# Altium schematic sheet MCU_GATEWAY.SchDoc
size A
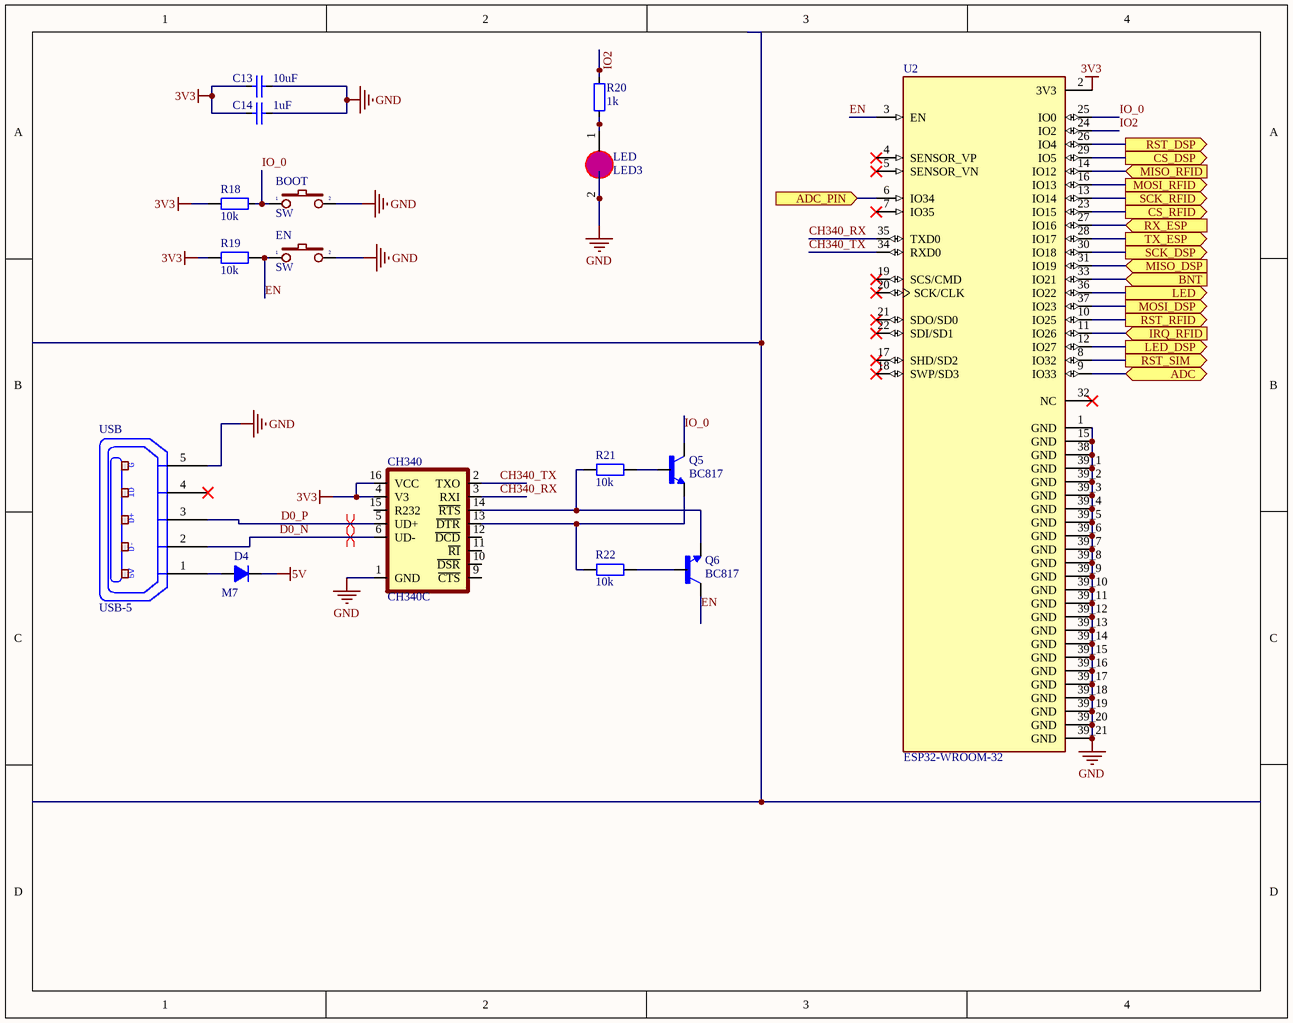
[diagram p0: MCU_GATEWAY.SchDoc]

## Parts
BOOT  SW  [SW-SMD]
C13  10uF  [CAP_0603]
C14  1uF  [CAP_0603]
CH340  CH340C  [SOP-16]
D4  M7  [SMA]
EN  SW  [SW-SMD]
LED  LED3  [LED0805]
Q5  BC817  [SOT95P240X97-3N]
Q6  BC817  [SOT95P240X97-3N]
R18  10k  [RES-SMD-0603]
R19  10k  [RES-SMD-0603]
R20  1k  [RES-SMD-0603]
R21  10k  [RES-SMD-0603]
R22  10k  [RES-SMD-0603]
U2  ESP32-WROOM-32  [MODULE_ESP32-WROOM-32]
USB  USB-5  [USB-M1]

## Ports
ADC (bidir), ADC_PIN (in), BNT (in), CS_DSP (out), CS_RFID (out), IRQ_RFID (in), LED (out), LED_DSP (out), MISO_DSP (in), MISO_RFID (in), MOSI_DSP (out), MOSI_RFID (out), RST_DSP (out), RST_RFID (out), RST_SIM (out), RX_ESP (in), SCK_DSP (out), SCK_RFID (out), TX_ESP (out)

## Nets
3V3: C13.1 C14.1 CH340.4(V3) CH340.16(VCC) R18.1 R19.1 U2.2(3V3)
5V: D4.2(K)
GND: BOOT.2 C13.2 C14.2 CH340.1(GND) EN.2 LED.2(K) U2.1(GND) U2.15(GND) U2.38(GND) U2.39_1(GND) U2.39_2(GND) U2.39_3(GND) U2.39_4(GND) U2.39_5(GND) U2.39_6(GND) U2.39_7(GND) U2.39_8(GND) U2.39_9(GND) U2.39_10(GND) U2.39_11(GND) U2.39_12(GND) U2.39_13(GND) U2.39_14(GND) U2.39_15(GND) U2.39_16(GND) U2.39_17(GND) U2.39_18(GND) U2.39_19(GND) U2.39_20(GND) U2.39_21(GND) USB.5(P5)
ADC: U2.9(IO33) ; port ADC
ADC_PIN: U2.6(IO34) ; port ADC_PIN
BNT: U2.33(IO21) ; port BNT
CH340_RX: CH340.3(RXI) U2.35(TXD0)
CH340_TX: CH340.2(TXO) U2.34(RXD0)
CS_DSP: U2.29(IO5) ; port CS_DSP
CS_RFID: U2.23(IO15) ; port CS_RFID
D0_N: CH340.6(UD-) USB.2(P2)
D0_P: CH340.5(UD+) USB.3(P3)
EN: EN.1 Q6.3(C) R19.2 U2.3(EN)
IO2: R20.1 U2.24(IO2)
IO_0: BOOT.1 Q5.3(C) R18.2 U2.25(IO0)
IRQ_RFID: U2.11(IO26) ; port IRQ_RFID
LED: U2.36(IO22) ; port LED
LED_DSP: U2.12(IO27) ; port LED_DSP
MISO_DSP: U2.31(IO19) ; port MISO_DSP
MISO_RFID: U2.14(IO12) ; port MISO_RFID
MOSI_DSP: U2.37(IO23) ; port MOSI_DSP
MOSI_RFID: U2.16(IO13) ; port MOSI_RFID
RST_DSP: U2.26(IO4) ; port RST_DSP
RST_RFID: U2.10(IO25) ; port RST_RFID
RST_SIM: U2.8(IO32) ; port RST_SIM
RX_ESP: U2.27(IO16) ; port RX_ESP
SCK_DSP: U2.30(IO18) ; port SCK_DSP
SCK_RFID: U2.13(IO14) ; port SCK_RFID
TX_ESP: U2.28(IO17) ; port TX_ESP
NetCH340_13: CH340.13(~{DTR}) Q5.2(E) R22.1
NetCH340_14: CH340.14(~{RTS}) Q6.2(E) R21.1
NetD4_1: D4.1(A) USB.1(P1)
NetLED_1: LED.1(A) R20.2
NetQ5_1: Q5.1(B) R21.2
NetQ6_1: Q6.1(B) R22.2

Not connected (* = marked no-connect by the designer): CH340 9(~{CTS}) 10(~{DSR}) 11(~{RI}) 12(~{DCD}) 15(R232); U2 4(SENSOR_VP)* 5(SENSOR_VN)* 7(IO35)* 17(SHD/SD2)* 18(SWP/SD3)* 19(SCS/CMD)* 20(SCK/CLK)* 21(SDO/SD0)* 22(SDI/SD1)* 32(NC)*; USB 4(P4)*

## Layout directives
differential pair: D0_N, D0_P

## Notes on the sheet
- Title
- Size:
- Date:
- A
- Number:
- Time:
- Revision:
- Sheet
- of
- File:
- (in symbol USB-5) G; ID; D+; D-; 5V

## Library data of the parts
BOOT EN = SW2: Switch button 2 pin; Value: SW chip 2 pin
C13 C14 = CapSMD: Capacitor; Value: 33p; Published: 8-Jun-2000; LatestRevisionDate: 17-Jul-2002; LatestRevisionNote: Re-released for DXP Platform.; PackageReference: RAD-0.3; Publisher: Altium Limited
CH340 = CH340C: USB to serial chip CH340; MF: WCH; Package: Package; Check_prices: https://www.snapeda.com/parts/CH340C/WCH/view-part/5428851/?ref=eda; Value: *; Price: None; MP: CH340C; Availability: Unavailable; SnapEDA_Link: https://www.snapeda.com/parts/CH340C/WCH/view-part/5428851/?ref=snap
D4 = D1A: Diode 1A; Value: 1N4007
LED = LED0805: LED SMD 0805
Q5 Q6 = BC817: Bipolar (BJT) Transistor NPN 45V 500mA 100MHz 250mW Surface Mount TO-236AB; MF: Rectron; MP: BC817; Value: *; SnapEDA_Link: https://www.snapeda.com/parts/BC817/Rectron/view-part/?ref=snap; Availability: In Stock; Purchase-URL: https://pricing.snapeda.com/search/part/BC817/?ref=eda; Package: SOT-23-3 Rectron; Price: None; Check_prices: https://www.snapeda.com/parts/BC817/Rectron/view-part/?ref=eda
R18-R22 = Resistor - SMD: Resistor SMD; Manufacturer: Generic Components; Class: Passive; Published: 08/06/2000; Publisher: Altium Hobart Technology Centre
U2 = ESP32-WROOM-32: Bluetooth, WiFi 802.11b/g/n, Bluetooth v4.2 +EDR, Class 1, 2 and 3 Transceiver Module 2.4GHz ~ 2.5GHz Antenna Not Included, U.FL Surface Mount; MF: Espressif Systems; Price: None; Availability: In Stock; MP: ESP32-WROOM-32; Package: Module Espressif Systems; SnapEDA_Link: https://www.snapeda.com/parts/ESP32-WROOM-32/Espressif+Systems/view-part/?ref=snap; Check_prices: https://www.snapeda.com/parts/ESP32-WROOM-32/Espressif+Systems/view-part/?ref=eda; Value: *; Purchase-URL: https://pricing.snapeda.com/search/part/ESP32-WROOM-32/?ref=eda
USB = USB-5: Manufacturer: FCI; Manufacturer Part Number: 10118193-0001LF; Connector Type: USB - micro B; Number of Contacts: 5; Gender: Receptacle; Specifications: USB 2.0; .Creator: MM; .Checked PCB: RF; Supplier 1: Digi-Key; RoHS: RoHS Compliant; Category: Connectors, Interconnects; Stock 1: 28642; Pricing 1: 1=0.46, 10=0.433, 25=0.3712, 50=0.3156, 100=0.3032, 250=0.27224, 500=0.25988 (USD); Packaging: Cut Tape (CT); Mounting Type: Surface Mount, Right Angle, Horizontal; Features: Shielded, Solder Retention; Ingress Protection: -; ComponentLink1URL: http://portal.fciconnect.com/Comergent//fci/drawing/10118193.pdf; ComponentLink1Description: http://portal.fciconnect.com/Comergent//fci/drawing/10118193.pdf; Supplier Part Number 1: 609-4616-1-ND; .Checked SCH: MM